# EAGLE design OWSlaveATTiny (EAGLE 6.4)
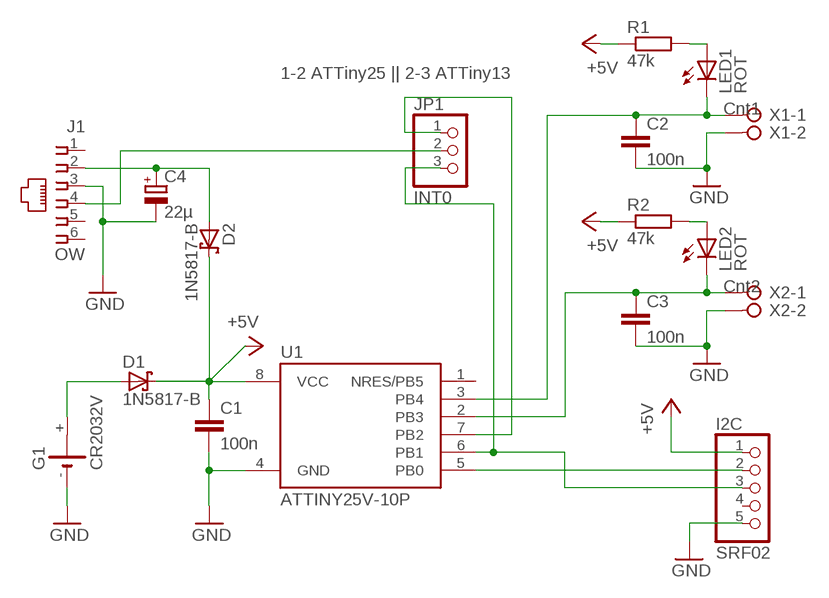
[diagram p0: schematic, sheet 1]

## Parts
C1  100n  C-EU050-025X075  [C050-025X075]
C2  100n  C-EU050-025X075  [C050-025X075]
C3  100n  C-EU050-025X075  [C050-025X075]
C4  22µ  CPOL-EUE2,5-6E  [E2,5-6E]
D1  1N5817-B  [DO41-7.6]
D2  1N5817-B  [DO41-7.6]
G1  CR2032V  [CR2032V]
I2C  SRF02  PINHD-1X5  [1X05]
J1  OW  520250-3  [520250-3]
JP1  INT0  PINHD-1X3  [1X03]
LED1  ROT  LED5MM  [LED5MM]
LED2  ROT  LED5MM  [LED5MM]
R1  47k  R-EU_0204/7  [0204/7]
R2  47k  R-EU_0204/7  [0204/7]
U1  ATTINY25V-10P  [PDIP08_300MIL]
X1  Cnt1  W237-02P  [W237-132]
X2  Cnt2  W237-02P  [W237-132]

## Nets
+5V: C1.1 D1.C D2.C I2C.1 R1.1 R2.1 U1.8(VCC)
GND: C1.2 C2.2 C3.2 C4.- G1.- I2C.5 J1.3 U1.4(GND) X1.2 X2.2
N$1: LED1.A R1.2
N$2: D1.A G1.+
N$3: J1.4 JP1.2
N$4: C2.1 LED1.K(C) U1.3(PB4) X1.1
N$5: C3.1 LED2.K(C) U1.2(PB3) X2.1
N$6: I2C.3 JP1.3 U1.6(PB1)
N$7: JP1.1 U1.7(PB2)
N$8: I2C.2 U1.5(PB0)
N$9: C4.+ D2.A J1.2
N$11: LED2.A R2.2
Unconnected: G1.+@1(+) I2C.4 J1.1 J1.5 J1.6 U1.1(NRES/PB5)

## Notes on the sheet
- 1-2 ATTiny25 || 2-3 ATTiny13

## Library data of the parts
C1-C3 = resistor:C-EU: CAPACITOR, European symbol
C4 = resistor:CPOL-EU: POLARIZED CAPACITOR, European symbol
D1 D2 = diode:1N581*: 1.0A SCHOTTKY BARRIER RECTIFIER Source: http://www.diodes.com/datasheets/ds23001.pdf
G1 = battery:CR2032V: LI BATTERY Varta
I2C = pinhead:PINHD-1X5: PIN HEADER
J1 = con-amp:520250-3: AMP connector; MF: TYCO ELECTRONICS; MPN: 5520250-3; OC_FARNELL: unknown; OC_NEWARK: 42K8724
JP1 = pinhead:PINHD-1X3: PIN HEADER
LED1 LED2 = led:LED: LED OSRAM: - CHIPLED LG R971, LG N971, LY N971, LG Q971, LY Q971, LO R971, LY R971 LH N974, LH R974 LS Q976, LO Q976, LY Q976 LO Q996 - Hyper CHIPLED LW Q18S LB Q993, LB Q99A, LB R99A - SideLED LS A670, LO A670, LY A670, LG A670, LP A670 LB A673, LV A673, LT A673, LW A673 LH A674 LY A675 LS A676, LA A676, LO A676, LY A676, LW A676 LS A679, LY A679, LG A679 - Hyper Micro SIDELED® LS Y876, LA Y876, LO Y876, LY Y876 LT Y87S - SmartLED LW L88C, LW L88S LB L89C, LB L89S, LG L890 LS L89K, LO L89K, LY L89K LS L896, LA L896, LO L896, LY L896 - TOPLED LS T670, LO T670, LY T670, LG T670, LP T670 LSG T670, LSP T670, LSY T670, LOP T670, LYG T670 LG T671, LOG T671, LSG T671 LB T673, LV T673, LT T673, LW T673 LH T674 LS T676, LA T676, LO T676, LY T676, LB T676, LH T676, LSB T676, LW T676 LB T67C, LV T67C, LT T67C, LS T67K, LO T67K, LY T67K, LW E67C LS E67B, LA E67B, LO E67B, LY E67B, LB E67C, LV E67C, LT E67C LW T67C LS T679, LY T679, LG T679 LS T770, LO T770, LY T770, LG T770, LP T770 LB T773, LV T773, LT T773, LW T773 LH T774 LS E675, LA E675, LY E675, LS T675 LS T776, LA T776, LO T776, LY T776, LB T776 LHGB T686 LT T68C, LB T68C - Hyper Mini TOPLED® LB M676 - Mini TOPLED Santana® LG M470 LS M47K, LO M47K, LY M47K Source: http://www.osram.convergy.de LUXEON: - LUMILED® LXK2-PW12-R00, LXK2-PW12-S00, LXK2-PW14-U00, LXK2-PW14-V00 LXK2-PM12-R00, LXK2-PM12-S00, LXK2-PM14-U00 LXK2-PE12-Q00, LXK2-PE12-R00, LXK2-PE12-S00, LXK2-PE14-T00, LXK2-PE14-U00 LXK2-PB12-K00, LXK2-PB12-L00, LXK2-PB12-M00, LXK2-PB14-N00, LXK2-PB14-P00, LXK2-PB14-Q00 LXK2-PR12-L00, LXK2-PR12-M00, LXK2-PR14-Q00, LXK2-PR14-R00 LXK2-PD12-Q00, LXK2-PD12-R00, LXK2-PD12-S00 LXK2-PH12-R00, LXK2-PH12-S00 LXK2-PL12-P00, LXK2-PL12-Q00, LXK2-PL12-R00 Source: www.luxeon.com KINGBRIGHT: KA-3528ASYC Source: www.kingbright.com
R1 R2 = resistor:R-EU_: RESISTOR, European symbol
U1 = _hhn_attiny25_45_85:ATTINY25*: ATMEL ATtiny 25 Packages: P = PDIP 08 30mil S = SOIC 08 EIAJ 208mil SS = SOIC 08 JEDEC 150mil Technologies Note: for complete ordering code (temp. range, finish, tape&reel etc.) see www.atmel.com • Supply Voltage: V = (1.8…5.5)V | [blank] = (2.7…5.5)V • Speed: 10 = 10 MHz | 20 = 20 MHz Author: Dipl.-Ing. FH Rainer Bayer HHN Hochschule Heilbronn (Heilbronn University), rainer.bayer@hs-heilbronn.de Ingenieurbüro ing-rb, mail@ing-rb.de
X1 X2 = con-wago-508:W237-02P: WAGO SREW CLAMP; OC_FARNELL: unknown; OC_NEWARK: unknown

## Board
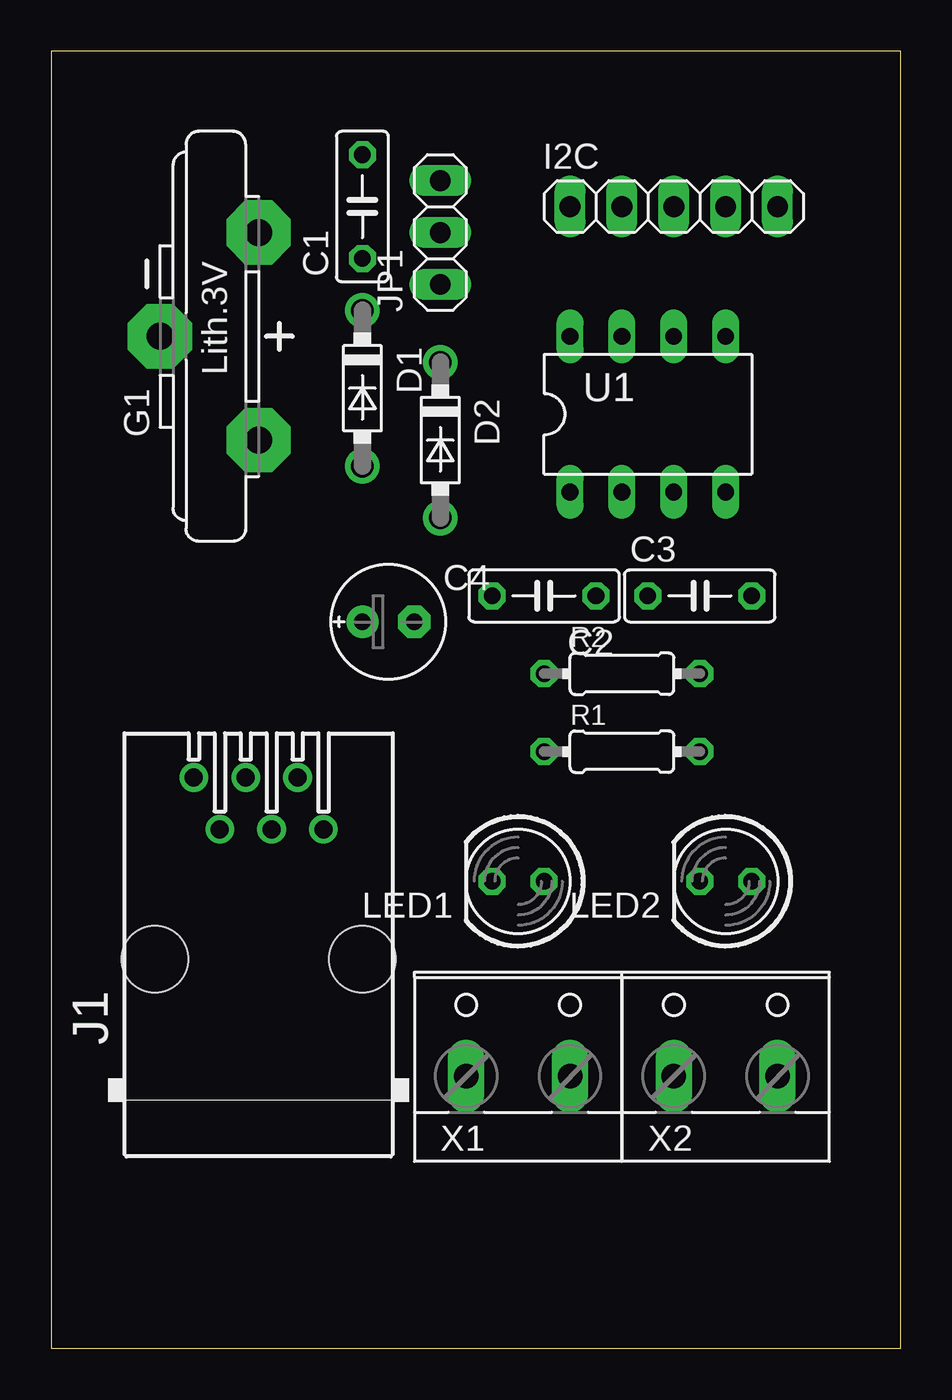
[diagram p1: board, top side]
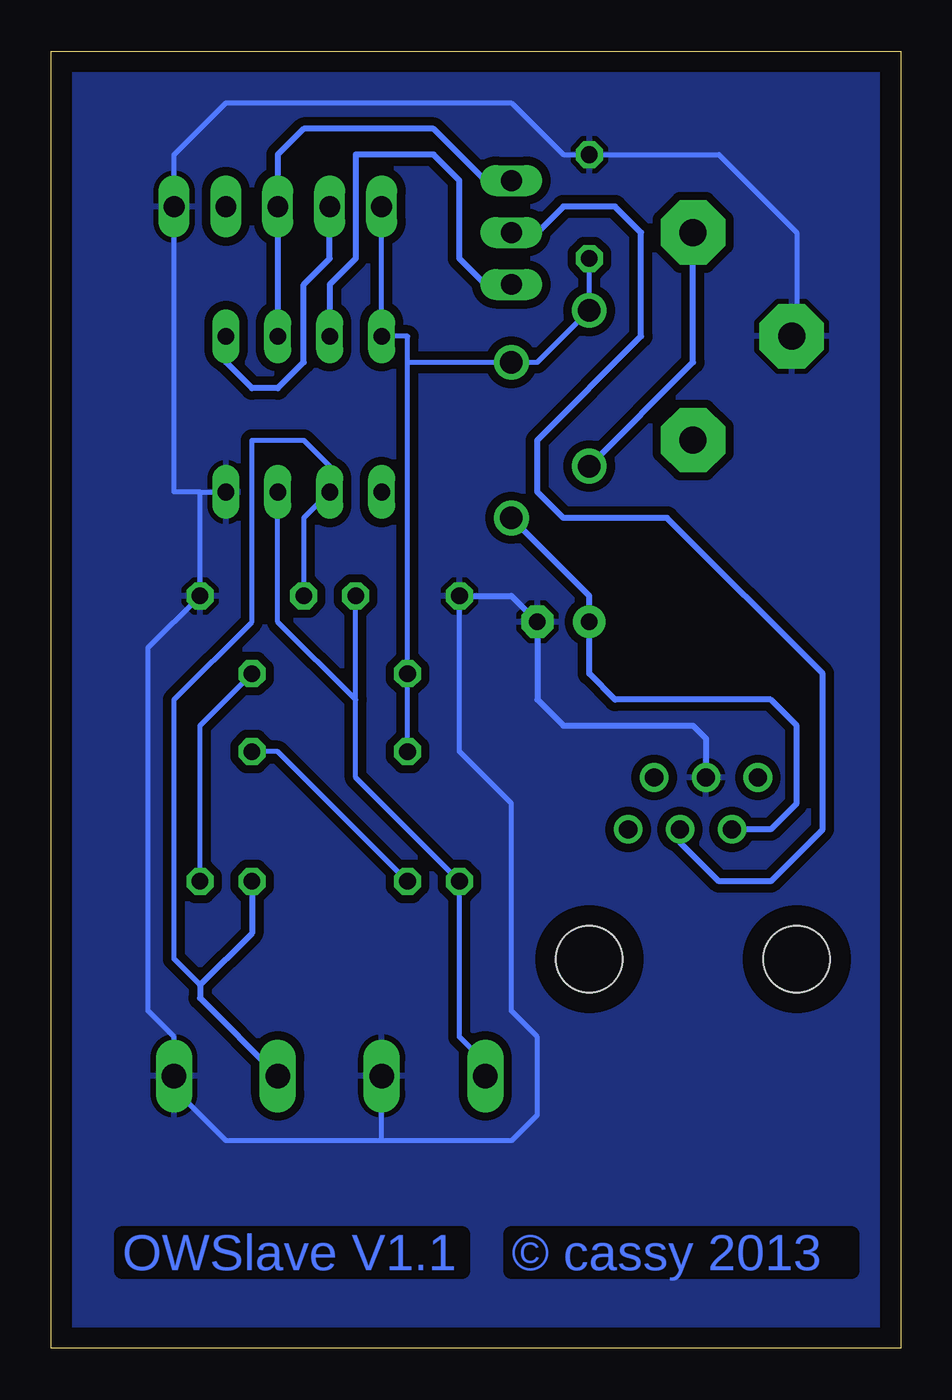
[diagram p2: board, bottom side, seen from below]

Size 41.58 x 63.49 mm. Coordinates in mm from the lower left corner, seen from the top.
Outline: 0,0 41.58,0 41.58,63.49 0,63.49 0,0
Copper layers (1*16): Top 0.035mm / dielectric 1.5mm / Bottom 0.035mm
Design rules "default": minimum track width 10mil, minimum drill 24mil, track to track 8mil, track to pad 8mil, pad to pad 8mil, via to via 8mil, smd to smd 8mil, copper to edge 40mil, drill to drill 8mil, minimum pad ring 10mil, minimum via ring 8mil, stop-mask expansion 4mil, vias tented up to drill 0mil, thermal gap 10mil

### Footprints (pad centres in the part's own frame; a part is rotated, then mirrored left to right if it is on the bottom)
C050-025X075 = drill 0.813 octagon: 1 -2.54,0; 2 2.54,0
E2,5-6E = drill 0.813 pad 1.575: + -1.27,0 | drill 0.813 pad 1.575 octagon: - 1.27,0
DO41-7.6 = drill 1.1 pad 1.7: A 3.81,0; C -3.81,0
CR2032V = drill 1.321 pad 3.15 octagon: + -2.54,-5.08; +@1 -2.54,5.08; - 2.286,0
1X05 = drill 1.016 long: 1 -5.08,0; 2 -2.54,0; 3 0,0; 4 2.54,0; 5 5.08,0
520250-3 = drill 0.889: 1 -3.175,8.89; 2 -1.905,6.35; 3 -0.635,8.89; 4 0.635,6.35; 5 1.905,8.89; 6 3.175,6.35 | hole 3.251: -5.08,0; 5.08,0
1X03 = drill 1.016 long: 1 -2.54,0; 2 0,0; 3 2.54,0
LED5MM = drill 0.813 octagon: A -1.27,0; K 1.27,0
0204/7 = drill 0.813 octagon: 1 -3.81,0; 2 3.81,0
PDIP08_300MIL = drill 0.813 long: 1 -3.81,-3.81; 2 -1.27,-3.81; 3 1.27,-3.81; 4 3.81,-3.81; 5 3.81,3.81; 6 1.27,3.81; 7 -1.27,3.81; 8 -3.81,3.81
W237-132 = drill 1.194 long: 1 -2.54,-0.635; 2 2.54,-0.635

### Placement (x,y rotation side)
C1  15.24,55.88 90 top
C2  24.13,36.83 180 top
C3  31.75,36.83 0 top
C4  16.51,35.56 0 top
D1  15.24,46.99 270 top
D2  19.05,44.45 270 top
G1  7.62,49.53 180 top
I2C  30.48,55.88 0 top
J1  10.16,19.05 0 top
JP1  19.05,54.61 90 top
LED1  22.86,22.86 180 top
LED2  33.02,22.86 180 top
R1  27.94,29.21 0 top
R2  27.94,33.02 0 top
U1  29.21,45.72 0 top
X1  22.86,13.97 0 top
X2  33.02,13.97 0 top

### Tracks (layer width: path | path; a pad name or v marks a point on that pad's centre or on a via)
+5V
  Bottom 0.254: C1.1 D1.C 17.78,48.26 D2.C 24.13,48.26 | R1.1 R2.1 24.13,48.26 | I2C.1 U1.8 24.13,49.53 24.13,48.26
GND
  Bottom 0.254: C2.2 21.59,29.21 19.05,26.67 19.05,16.51 17.78,15.24 17.78,11.43 19.05,10.16 25.4,10.16 | G1.- 5.08,49.53 5.08,54.61 8.89,58.42 C1.2 16.51,58.42 19.05,60.96 33.02,60.96 35.56,58.42 I2C.5 35.56,41.91 34.29,41.91 | 25.4,10.16 33.02,10.16 35.56,12.7 X2.2 35.56,15.24 36.83,16.51 36.83,34.29 C3.2 34.29,41.91 | 25.4,10.16 X1.2 | 34.29,41.91 U1.4
  Bottom 0.305: C2.2 19.05,36.83 C4.- 17.78,31.75 16.51,30.48 10.16,30.48 9.53,29.84 J1.3
  pour Bottom (isolate 0.406): 0,63.5 41.91,63.5 41.91,0 0,0
N$1
  Bottom 0.254: LED1.A 30.48,29.21 R1.2
N$2
  Bottom 0.305: G1.+ 10.16,48.26 D1.A
N$3
  Bottom 0.305: J1.4 10.79,24.77 8.89,22.86 6.35,22.86 3.81,25.4 3.81,33.02 11.43,40.64 16.51,40.64 17.78,41.91 17.78,44.45 12.7,49.53 12.7,54.61 13.97,55.88 16.51,55.88 17.78,54.61 JP1.2
N$4
  Bottom 0.254: X1.1 20.32,13.97 21.59,15.24 LED1.K 26.67,27.94 26.67,31.75 | 26.67,31.75 C2.1 | U1.3 30.48,35.56 26.67,31.75
N$5
  Bottom 0.254: C3.1 29.21,40.64 U1.2 27.94,43.18 29.21,44.45 31.75,44.45 31.75,35.56 35.56,31.75 35.56,19.05 34.29,17.78
  Bottom 0.305: LED2.K 31.75,20.32 34.29,17.78 34.29,17.14 X2.1
N$6
  Bottom 0.305: U1.6 I2C.3 30.48,58.42 29.21,59.69 22.86,59.69 20.32,57.15 JP1.3
N$7
  Bottom 0.305: U1.7 27.94,52.07 26.67,53.34 26.67,58.42 22.86,58.42 21.59,57.15 21.59,53.34 20.32,52.07 JP1.1
N$8
  Bottom 0.305: U1.5 33.02,48.26 31.75,46.99 30.48,46.99 29.21,48.26 29.21,52.07 27.94,53.34 I2C.2
N$9
  Bottom 0.305: J1.2 6.35,25.4 5.08,26.67 5.08,30.48 6.35,31.75 13.97,31.75 15.24,33.02 C4.+ 15.24,36.83 D2.A
N$11
  Bottom 0.254: LED2.A 34.29,30.48 R2.2

### Text on the board
Bottom: © cassy 2013 | OWSlave V1.1